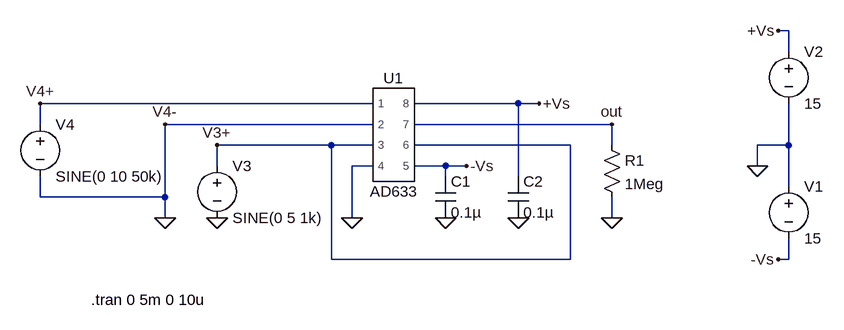
[diagram p0: schematic Draft2.asc]
Draft2.asc, the LTspice schematic file:
Version 4
SHEET 1 920 680
WIRE 864 -32 848 -32
WIRE 864 0 864 -32
WIRE 224 80 -288 80
WIRE 448 80 288 80
WIRE 480 80 448 80
WIRE -288 112 -288 80
WIRE 224 112 -96 112
WIRE 592 112 288 112
WIRE 160 144 -16 144
WIRE 224 144 160 144
WIRE 528 144 288 144
WIRE 592 144 592 112
WIRE 864 144 864 80
WIRE 864 144 816 144
WIRE -16 176 -16 144
WIRE 224 176 192 176
WIRE 336 176 288 176
WIRE 368 176 336 176
WIRE 816 176 816 144
WIRE 336 192 336 176
WIRE 448 192 448 80
WIRE 864 208 864 144
WIRE -288 224 -288 192
WIRE -96 224 -96 112
WIRE -96 224 -288 224
WIRE -96 256 -96 224
WIRE 192 256 192 176
WIRE 592 256 592 224
WIRE 160 320 160 144
WIRE 528 320 528 144
WIRE 528 320 160 320
WIRE 864 320 864 288
WIRE 864 320 848 320
FLAG 816 176 0
FLAG 848 320 -Vs
FLAG 848 -32 +Vs
FLAG 336 256 0
FLAG 368 176 -Vs
FLAG 448 256 0
FLAG 480 80 +Vs
FLAG 192 256 0
FLAG 592 256 0
FLAG -16 256 0
FLAG 592 112 out
FLAG -288 80 V4+
FLAG -96 112 V4-
FLAG -16 144 V3+
FLAG -96 256 0
SYMBOL AutoGenerated\\AD633 256 128 R0
SYMATTR InstName U1
SYMBOL voltage 864 192 R0
WINDOW 123 0 0 Left 0
WINDOW 39 0 0 Left 0
SYMATTR InstName V1
SYMATTR Value 15
SYMBOL voltage 864 -16 R0
WINDOW 123 0 0 Left 0
WINDOW 39 0 0 Left 0
SYMATTR InstName V2
SYMATTR Value 15
SYMBOL cap 320 192 R0
SYMATTR InstName C1
SYMATTR Value 0.1µ
SYMBOL cap 432 192 R0
SYMATTR InstName C2
SYMATTR Value 0.1µ
SYMBOL res 576 128 R0
SYMATTR InstName R1
SYMATTR Value 1Meg
SYMBOL voltage -16 160 R0
WINDOW 123 0 0 Left 0
WINDOW 39 0 0 Left 0
SYMATTR InstName V3
SYMATTR Value SINE(0 5 1k)
SYMBOL voltage -288 96 R0
WINDOW 123 0 0 Left 0
WINDOW 39 0 0 Left 0
SYMATTR InstName V4
SYMATTR Value SINE(0 10 50k)
TEXT -210 382 Left 2 !.tran 0 5m 0 10u

The netlist it stands for:
* Draft2.asc
XU1 V4+ 0 V3+ 0 -Vs V3+ out +Vs AD633  ; pins 1 2 3 4 5 6 7 8
V1 0 -Vs 15
V2 +Vs 0 15
C1 -Vs 0 0.1µ
C2 +Vs 0 0.1µ
R1 out 0 1Meg
V3 V3+ 0 SINE(0 5 1k)
V4 V4+ 0 SINE(0 10 50k)
.tran 0 5m 0 10u
.lib C:\Users\Admin\Downloads\ad633.cir
.backanno
.end